# EasyEDA Pro project OSC1.eprj, schematic 编码器-3
Create Date: 2024-10-09; Page Name: P1; Project Name: OSC; Schematic Name: P1; Update Date: 2024-10-09; Company: 嘉立创EDA; Page Size: A4; Version: V1.0
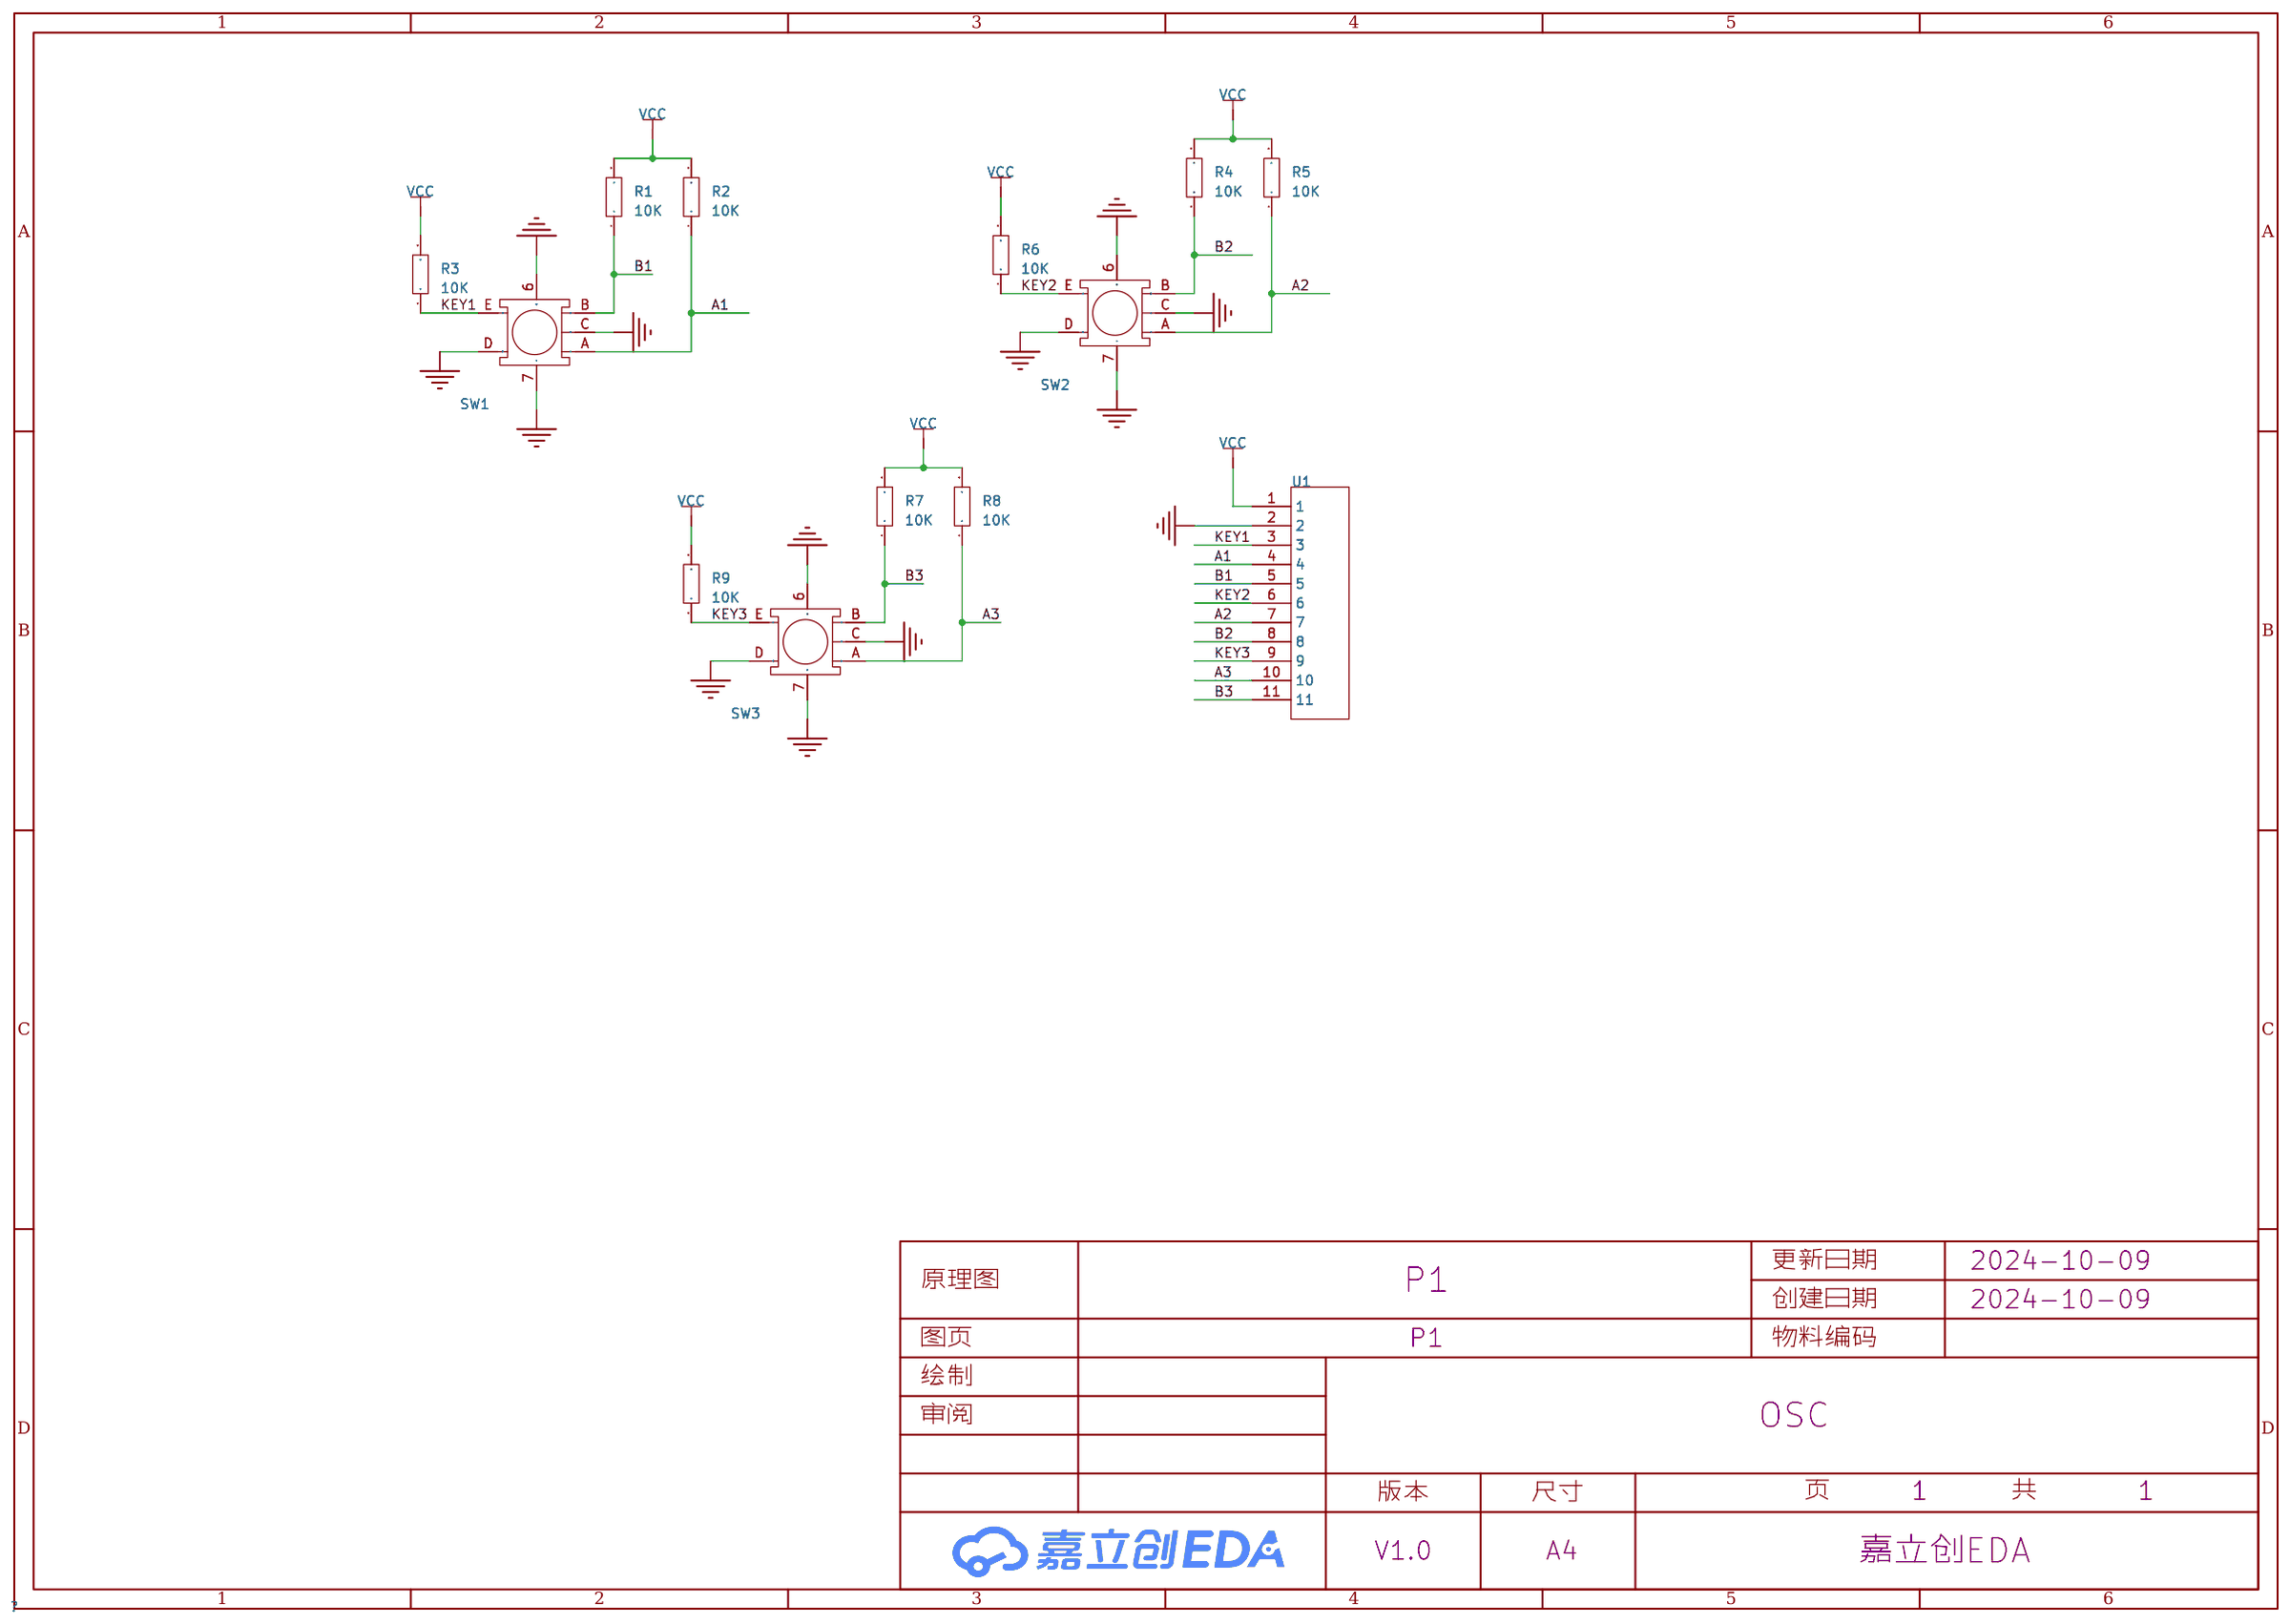
[diagram p8: schematic sheet]

## Parts
R1  10K  [240*80mil]
R2  10K  [240*80mil]
R3  10K  [240*80mil]
R4  10K  [240*80mil]
R5  10K  [240*80mil]
R6  10K  [240*80mil]
R7  10K  [240*80mil]
R8  10K  [240*80mil]
R9  10K  [240*80mil]
SW1  -  [旋转编码器]
SW2  -  [旋转编码器]
SW3  -  [旋转编码器]
U1  -  [CH2.54-11插座]

## Library data of the parts
R1-R9 = 插件电阻
SW1-SW3 = EC11E15244B2: Supplier Footprint: 插件
U1 = HDR-11P

## Nets
GND: SW1.6 SW1.7 SW1.C SW1.D SW2.6 SW2.7 SW2.C SW2.D SW3.6 SW3.7 SW3.C SW3.D U1.2
VCC: R1.2 R2.2 R3.2 R4.2 R5.2 R6.2 R7.2 R8.2 R9.2 U1.1
A1: R2.1 SW1.A U1.4
A2: R5.1 SW2.A U1.7
A3: R8.1 SW3.A U1.10
B1: R1.1 SW1.B U1.5
B2: R4.1 SW2.B U1.8
B3: R7.1 SW3.B U1.11
KEY1: R3.1 SW1.E U1.3
KEY2: R6.1 SW2.E U1.6
KEY3: R9.1 SW3.E U1.9
